# Altium schematic sheet Wall_Power_to_+-20.SchDoc
size A; SheetNumber: 2; SheetTotal: 6
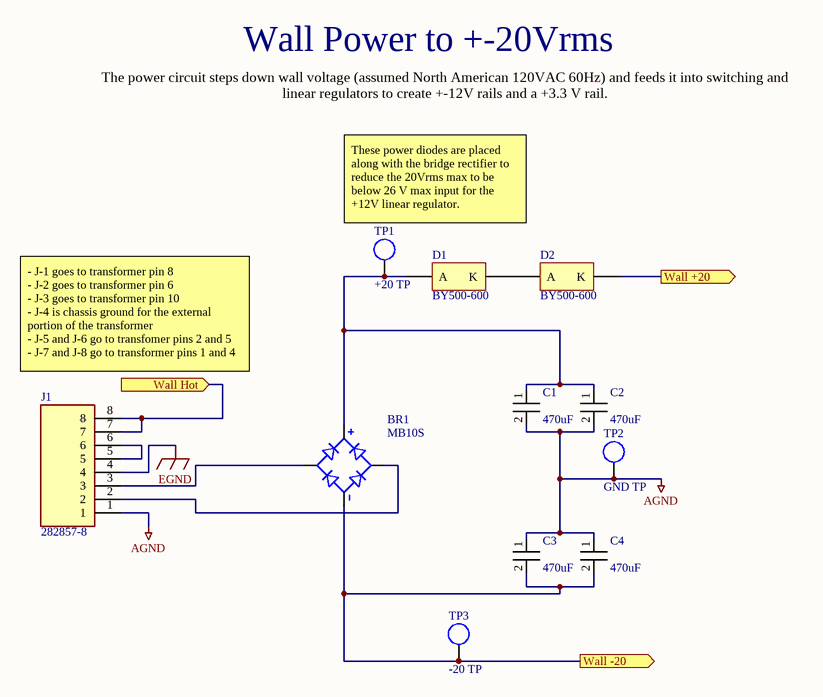
[diagram p0: Wall_Power_to_+-20.SchDoc]

## Parts
BR1  MB10S  [SOIC245P670X290-4N]
C1  470uF  [PCBComponent_1]
C2  470uF  [PCBComponent_1]
C3  470uF  [PCBComponent_1]
C4  470uF  [PCBComponent_1]
D1  BY500-600  [ONSC-AXIAL_LEAD-2-267-05_V]
D2  BY500-600  [ONSC-AXIAL_LEAD-2-267-05_V]
J1  282857-8  [282857-8-Footprint-1]
TP1  +20 TP  [PCBComponent_1]
TP2  GND TP  [PCBComponent_1]
TP3  -20 TP  [PCBComponent_1]

## Ports
Wall +20 (out), Wall -20 (out), Wall Hot (in)

## Nets
AGND: C1.2(-) C2.2(-) C3.1(+) C4.1(+) J1.1 TP2.TP
EGND: J1.4
Wall +20: D2.1(K) ; port Wall +20
Wall -20: BR1.2(NEG) C3.2(-) C4.2(-) TP3.TP ; port Wall -20
Wall Hot: J1.7 J1.8 ; port Wall Hot
NetBR1_1: BR1.1(POS) C1.1(+) C2.1(+) D1.2(A) TP1.TP
NetBR1_3: BR1.3(AC2) J1.3
NetBR1_4: BR1.4(AC1) J1.2
NetD1_1: D1.1(K) D2.2(A)
NetJ1_5: J1.5 J1.6

## Notes on the sheet
- Wall Power to +-20Vrms
- The power circuit steps down wall voltage (assumed North American 120VAC 60Hz) and feeds it into switching and linear regulators to create +-12V rails and a +3.3 V rail.
- These power diodes are placed along with the bridge rectifier to reduce the 20Vrms max to be below 26 V max input for the +12V linear regulator.
- (near J1) - J-1 goes to transformer pin 8
  - J-2 goes to transformer pin 6
  - J-3 goes to transformer pin 10
  - J-4 is chassis ground for the external portion of the transformer
  - J-5 and J-6 go to transfomer pins 2 and 5
  - J-7 and J-8 go to transformer pins 1 and 4

## Library data of the parts
BR1 = MB10S: Bridge Rectifier Single Phase Standard 1kV Surface Mount 4-SOIC; MF: ON Semiconductor; MP: MB10S; Package: SOIC-4 ON Semiconductor; Digi-Key_Purchase_URL: https://www.digikey.com/product-detail/en/on-semiconductor/MB10S/MB10SCT-ND/2444921?utm_source=snapeda&utm_medium=aggregator&utm_campaign=symbol; Digi-Key_Part_Number: MB10SCT-ND; SnapEDA_Link: https://www.snapeda.com/parts/MB10S/ON%20Semiconductor/view-part/1686091/?ref=snap; Value: *
C1-C4 = UPS1H471MPD-4: 470uF Joe Knows Electronics Capacitor Footprint.   13x20 mm diameter and length, Leads are 0.6mm, 5mm dist between leads, 4mm from edge
D1 D2 = CMP-1055-00010-1: Rectifier, 2-Pin Axial_Lead, Pb-Free, Tape and Reel; Manufacturer: On Semiconductor; PartNumber: 1N5822RLG; Configuration: Single; IFSM Max (A): 80; ComponentLink2URL: http://www.onsemi.cn/pub_link/Collateral/1N5820-D.PDF; Packing: Tape and Reel; ComponentLink1Description: Manufacturer URL; PackageDescription: 2-Pin, Axial Lead, Diameter 5.05 mm; ComponentLink3Description: Package Specification; PackageReference: AXIAL_LEAD-2-267-05; PackageVersion: Rev. G, 06/2000; ComponentLink1URL: http://www.onsemi.com/; ComponentLink2Description: Datasheet; RoHS: TRUE; Mounting Technology: Through Hole; DatasheetVersion: Rev. 10; ComponentLink3URL: http://www.onsemi.com/pub_link/Collateral/267-05.PDF
J1 = CMP-002-00073-1: Conn Eurostyle Block HDR 8 POS 5.08mm Solder ST Thru-Hole 24A Carton
TP1-TP3 = Component_1